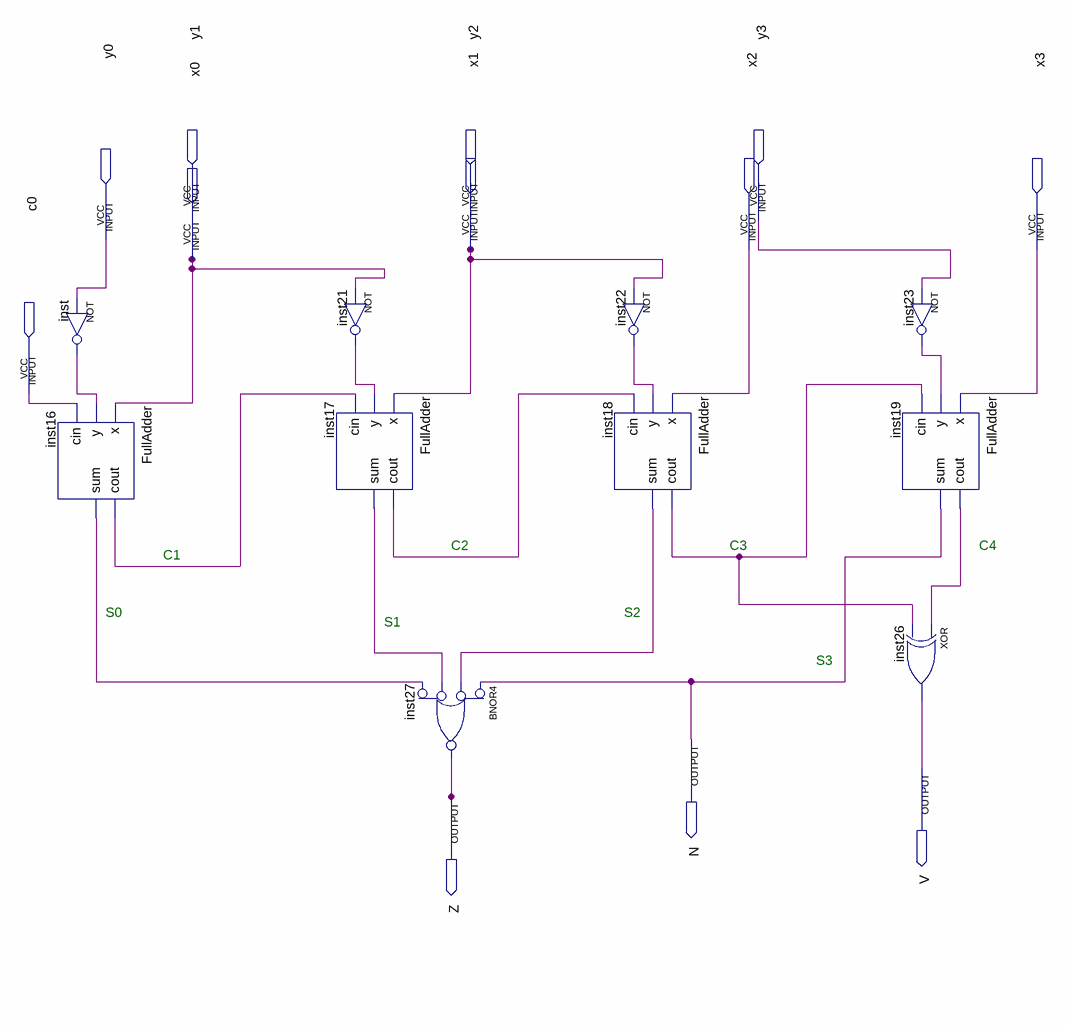
[diagram p0: schematic sheet]
// Quartus schematic blockD.bdf as structural Verilog: 10 symbols, 12 pins
module blockD (
  input  y1,
  input  y2,
  input  y3,
  input  y0,
  input  x1,
  input  x2,
  input  x3,
  input  x0,
  input  c0,
  output N,
  output V,
  output Z
);

  wire inst16_cout, inst16_sum, inst17_cout, inst17_sum, inst18_cout, inst18_sum, inst19_cout, inst21_out,
       inst22_out, inst23_out, inst_out;

  not inst (inst_out, y0);
  FullAdder inst16 (.x(x0), .y(inst_out), .cin(c0), .cout(inst16_cout), .sum(inst16_sum));
  not inst21 (inst21_out, x0);
  FullAdder inst17 (.x(x1), .y(inst21_out), .cin(inst16_cout), .cout(inst17_cout), .sum(inst17_sum));
  nor inst27 (Z, ~N, ~inst18_sum, ~inst17_sum, ~inst16_sum);  // BNOR4
  FullAdder inst18 (.x(x2), .y(inst22_out), .cin(inst17_cout), .cout(inst18_cout), .sum(inst18_sum));
  not inst22 (inst22_out, x1);
  not inst23 (inst23_out, y3);
  FullAdder inst19 (.x(x3), .y(inst23_out), .cin(inst18_cout), .cout(inst19_cout), .sum(N));
  xor inst26 (V, inst19_cout, inst18_cout);

  assign y1 = x0;
  assign y2 = x1;

  // Notes on the sheet:
  //   C2
  //   C3
  //   C4
  //   C1
  //   S0
  //   S2
  //   S1
  //   S3
endmodule
